# Altium schematic sheet Control.SchDoc
size A
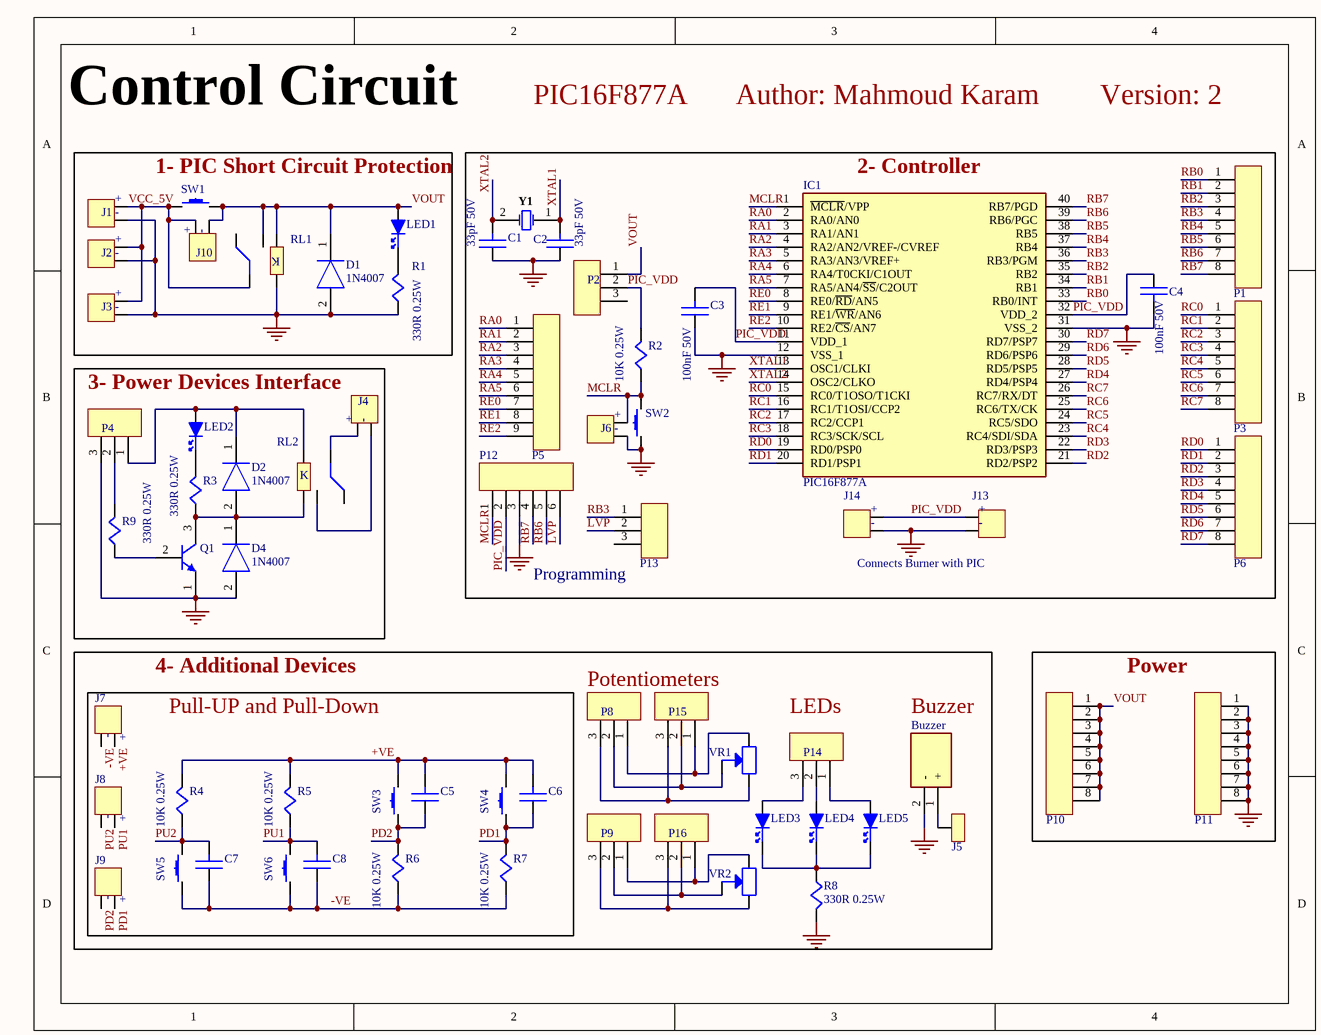
[diagram p0: Control.SchDoc]

## Parts
Buzzer  Buzzer 5V  [Buzzer 7.62mm pitch 12mm dia]  (value not drawn)
C1  33pF 50V  [Cap Ceramic 104]
C2  33pF 50V  [Cap Ceramic 104]
C3  100nF 50V  [Cap Ceramic 104 2.54]
C4  100nF 50V  [Cap Ceramic 104 2.54]
C5  100nF 50V  [Cap Ceramic 104]  (value not drawn)
C6  100nF 50V  [Cap Ceramic 104]  (value not drawn)
C7  100nF 50V  [Cap Ceramic 104]  (value not drawn)
C8  100nF 50V  [Cap Ceramic 104]  (value not drawn)
D1  1N4007  [Diode 10.16mm TH H]
D2  1N4007  [Diode 2.54mm TH V]
D4  1N4007  [Diode 2.54mm TH V]
IC1  PIC16F877A  [PIC16F877A TH With Socket]
J1  JST on PCB Connector 2 pins  [JST_B2B TH]  (value not drawn)
J2  Terminal Block Green 5.08mm  [Screw Terminal Block 5.08mm TH Green]  (value not drawn)
J3  DC Power Jack PJ002  [DC Power Jack 2.1mm PJ-002AH TH]  (value not drawn)
J4  Terminal Block Blue 5.08mm  [Screw Terminal Block 5.08mm TH Blue]  (value not drawn)
J5  Pin  [Pin]  (value not drawn)
J6  Header male 2 ways  [Header Male 2.54mm 2 Pins TH]  (value not drawn)
J7  Header male 2 ways  [Header Male 2.54mm 2 Pins TH]  (value not drawn)
J8  Header male 2 ways  [Header Male 2.54mm 2 Pins TH]  (value not drawn)
J9  Header male 2 ways  [Header Male 2.54mm 2 Pins TH]  (value not drawn)
J10  Header male 2 ways  [Header Male 2.54mm 2 Pins TH]  (value not drawn)
J13  Header male 2 ways  [Header Male 2.54mm 2 Pins TH]  (value not drawn)
J14  Header male 2 ways  [Header Male 2.54mm 2 Pins TH]  (value not drawn)
LED1  RED 5mm  [LED 5mm Red TH]  (value not drawn)
LED2  Green 5mm  [LED 5mm Green TH]  (value not drawn)
LED3  RED 5mm  [LED 5mm Red TH]  (value not drawn)
LED4  Green 5mm  [LED 5mm Green TH]  (value not drawn)
LED5  Yellow 5mm  [LED 5mm Yellow TH]  (value not drawn)
P1  Header male 8 ways  [Header Male 2.54mm 8 Pins TH]  (value not drawn)
P2  Header male 3 ways with jumper  [Header Male 2.54mm 3 Pins with jumper TH]  (value not drawn)
P3  Header male 8 ways  [Header Male 2.54mm 8 Pins TH]  (value not drawn)
P4  Header male 3 ways  [Header Male 2.54mm 3 Pins TH]  (value not drawn)
P5  Header male 9 ways  [Header Male 2.54mm 9 Pins TH]  (value not drawn)
P6  Header male 8 ways  [Header Male 2.54mm 8 Pins TH]  (value not drawn)
P8  Header male 3 ways  [Header Male 2.54mm 3 Pins TH]  (value not drawn)
P9  Header male 3 ways  [Header Male 2.54mm 3 Pins TH]  (value not drawn)
P10  Header male 8 ways  [Header Male 2.54mm 8 Pins TH]  (value not drawn)
P11  Header male 8 ways  [Header Male 2.54mm 8 Pins TH]  (value not drawn)
P12  Header male 6 ways  [Header Male 2.54mm 6 Pins TH]  (value not drawn)
P13  Header male 3 ways with jumper  [Header Male 2.54mm 3 Pins with jumper TH]  (value not drawn)
P14  Header male 3 ways  [Header Male 2.54mm 3 Pins TH]  (value not drawn)
P15  Header male 3 ways  [Header Male 2.54mm 3 Pins TH]  (value not drawn)
P16  Header male 3 ways  [Header Male 2.54mm 3 Pins TH]  (value not drawn)
Q1  Transistor PN2222  [PN2222]  (value not drawn)
R1  330R 0.25W  [Res 7.62mm H TH]
R2  10K 0.25W  [Res 7.62mm H TH]
R3  330R 0.25W  [Res 2.54mm V TH]
R4  10K 0.25W  [Res 2.54mm V TH]
R5  10K 0.25W  [Res 2.54mm V TH]
R6  10K 0.25W  [Res 2.54mm V TH]
R7  10K 0.25W  [Res 2.54mm V TH]
R8  330R 0.25W  [Res 7.62mm H TH]
R9  330R 0.25W  [Res 2.54mm V TH]
RL1  Relay 5V SRD-05VDC-SL-C  [Relay SRD-05VDC-SL-C]  (value not drawn)
RL2  Relay 5V SRD-05VDC-SL-C  [Relay SRD-05VDC-SL-C]  (value not drawn)
SW1  Tactile Switch 4 poles  [Tactile switch 6*6*5 TH]  (value not drawn)
SW2  Tactile Switch 4 poles  [Tactile switch 6*6*5 TH]  (value not drawn)
SW3  Tactile Switch 4 poles  [Tactile switch 6*6*5 TH]  (value not drawn)
SW4  Tactile Switch 4 poles  [Tactile switch 6*6*5 TH]  (value not drawn)
SW5  Tactile Switch 4 poles  [Tactile switch 6*6*5 TH]  (value not drawn)
SW6  Tactile Switch 4 poles  [Tactile switch 6*6*5 TH]  (value not drawn)
VR1  Potentiometer 10K  [Potentiometer 90 deg dual]  (value not drawn)
VR2  Potentiometer 10K  [Potentiometer 90 deg dual]  (value not drawn)
Y1  Crystal 8MHz  [FOX-FOXSLF-2_V]  (value not drawn)

## Blocks framed on the sheet
1- PIC Short Circuit Protection: D1 J1-J3 J10 LED1 R1 RL1 SW1
2- Controller: C1-C4 IC1 J6 J13 J14 P1-P3 P5 P6 P12 P13 R2 SW2 Y1
3- Power Devices Interface: D2 D4 J4 LED2 P4 Q1 R3 R9 RL2
Power: P10 P11

## Nets
GND: Buzzer.2(-) C1.1 C2.1 C3.1 C4.2 D1.2(A) D4.2(A) IC1.12(VSS_1) IC1.31(VSS_2) J1.2 J2.2 J3.2 J6.2 J13.2 J14.2 P4.3 P11.1 P11.2 P11.3 P11.4 P11.5 P11.6 P11.7 P11.8 P12.3 Q1.1(E) R1.1 R8.2 RL1.2 SW2.1
+VE: C5.2 C6.2 J7.1 R4.2 R5.2 SW3.2 SW4.2
-VE: C7.1 C8.1 J7.2 R6.1 R7.1 SW5.1 SW6.1
LVP: P12.6 P13.2
MCLR: IC1.1(~{MCLR}/VPP) J6.1 P12.1 R2.1 SW2.2
PD1: C6.1 J9.1 R7.2 SW4.1
PD2: C5.1 J9.2 R6.2 SW3.1
PIC_VDD: C3.2 C4.1 IC1.11(VDD_1) IC1.32(VDD_2) J13.1 J14.1 P2.2 P12.2 R2.2
PU1: C8.2 J8.1 R5.1 SW6.2
PU2: C7.2 J8.2 R4.1 SW5.2
RA0: IC1.2(RA0/AN0) P5.1
RA1: IC1.3(RA1/AN1) P5.2
RA2: IC1.4(RA2/AN2/VREF-/CVREF) P5.3
RA3: IC1.5(RA3/AN3/VREF+) P5.4
RA4: IC1.6(RA4/T0CKI/C1OUT) P5.5
RA5: IC1.7(RA5/AN4/~{SS}/C2OUT) P5.6
RB0: IC1.33(RB0/INT) P1.1
RB1: IC1.34(RB1) P1.2
RB2: IC1.35(RB2) P1.3
RB3: IC1.36(RB3/PGM) P1.4 P13.1
RB4: IC1.37(RB4) P1.5
RB5: IC1.38(RB5) P1.6
RB6: IC1.39(RB6/PGC) P1.7 P12.5
RB7: IC1.40(RB7/PGD) P1.8 P12.4
RC0: IC1.15(RC0/T1OSO/T1CKI) P3.1
RC1: IC1.16(RC1/T1OSI/CCP2) P3.2
RC2: IC1.17(RC2/CCP1) P3.3
RC3: IC1.18(RC3/SCK/SCL) P3.4
RC4: IC1.23(RC4/SDI/SDA) P3.5
RC5: IC1.24(RC5/SDO) P3.6
RC6: IC1.25(RC6/TX/CK) P3.7
RC7: IC1.26(RC7/RX/DT) P3.8
RD0: IC1.19(RD0/PSP0) P6.1
RD1: IC1.20(RD1/PSP1) P6.2
RD2: IC1.21(RD2/PSP2) P6.3
RD3: IC1.22(RD3/PSP3) P6.4
RD4: IC1.27(RD4/PSP4) P6.5
RD5: IC1.28(RD5/PSP5) P6.6
RD6: IC1.29(RD6/PSP6) P6.7
RD7: IC1.30(RD7/PSP7) P6.8
RE0: IC1.8(RE0/~{RD}/AN5) P5.7
RE1: IC1.9(RE1/~{WR}/AN6) P5.8
RE2: IC1.10(RE2/~{CS}/AN7) P5.9
VCC_5V: J1.1 J2.1 J3.1 J10.1 RL1.1(COM) SW1.1
VOUT: D1.1(K) J10.2 LED1.1 P2.1 P10.1 P10.2 P10.3 P10.4 P10.5 P10.6 P10.7 P10.8 RL1.3 RL1.5(NO) SW1.2
XTAL1: C2.2 IC1.13(OSC1/CLKI) Y1.1
XTAL2: C1.2 IC1.14(OSC2/CLKO) Y1.2
NetBuzzer_1: Buzzer.1(+) J5.1
NetD2_1: D2.1(K) LED2.1 P4.1 RL2.2
NetD2_2: D2.2(A) D4.1(K) Q1.3(C) R3.1 RL2.3
NetJ4_1: J4.1 RL2.1(COM)
NetJ4_2: J4.2 RL2.5(NO)
NetLED1_2: LED1.2 R1.2
NetLED2_2: LED2.2 R3.2
NetLED3_1: LED3.1 P14.3
NetLED3_2: LED3.2 LED4.2 LED5.2 R8.1
NetLED4_1: LED4.1 P14.2
NetLED5_1: LED5.1 P14.1
NetP4_2: P4.2 R9.2
NetP8_1: P8.1 P15.1 VR1.1
NetP8_2: P8.2 P15.2 VR1.2
NetP8_3: P8.3 P15.3 VR1.3
NetP9_1: P9.1 P16.1 VR2.1
NetP9_2: P9.2 P16.2 VR2.2
NetP9_3: P9.3 P16.3 VR2.3
NetQ1_2: Q1.2(B) R9.1

Not connected (* = marked no-connect by the designer): P2 3; P13 3; RL1 4(NC); RL2 4(NC)

## Notes on the sheet
- Control Circuit
- PIC16F877A
- Author: Mahmoud Karam
- Version: 2
- (near P13) Programming
- Connects Burner with PIC
- 4- Additional Devices
- Pull-UP and Pull-Down
- Potentiometers
- LEDs
- Buzzer
- (in symbol Relay_SPDT) K
- (in symbol Terminal_Block_2Pos) +; -

## Library data of the parts
Buzzer = Speaker: Loudspeaker or Buzzer; Manufacturer_Name: RS Components; Manufacturer_Part_Number: 7243178; Datasheet Link: https://docs.rs-online.com/093f/0900766b815817dd.pdf; Height: 14.5mm
C1 C2 = Ceramic_Capacitors: Capacitor Ceramic; Manufacturer: KEMET; Manufacturer Part Number: C320C104M5R5TA7301; Lead/Base Style: Straight; Dissipation Factor: 2.5%; Capacitance: 100nF; Dielectric: X7R; Tolerance: 20%; Lead Diameter: 0.51mm; Supplier 1: Digi-Key; RoHS: Yes; Category: Ceramic Capacitors; Stock 1: 8222; Pricing 1: 1=0.24000, 10=0.16200, 50=0.10800, 100=0.09180, 500=0.06480, 1000=0.05670 (USD); Case/Package: Dipped; Min Operating Temperature: -55°C; Max Operating Temperature: 125°C; Termination: Radial; Packaging: Tape and Reel; Package Quantity: 2500; Voltage Rating: 50V; Length: 6.6mm; Width: 5.08mm; Height: 3.18mm; Lead Pitch: 2.54mm; Depth: 3.18mm; ComponentLink1URL: https://datasheet.ciiva.com/5396/f3101-goldmax-5396597.pdf?src-supplier=Mouser; ComponentLink1Description: https://datasheet.ciiva.com/5396/f3101-goldmax-5396597.pdf?src-supplier=Mouser; Supplier Part Number 1: 399-13978-1-ND
C3-C8 = Ceramic_Capacitors: Capacitor Ceramic; Manufacturer: KEMET; Manufacturer Part Number: C320C104M5R5TA7301; Lead/Base Style: Straight; Dissipation Factor: 2.5%; Dielectric: X7R; Tolerance: 20%; Lead Diameter: 0.51mm; Supplier 1: Digi-Key; RoHS: Yes; Category: Ceramic Capacitors; Stock 1: 8222; Pricing 1: 1=0.24000, 10=0.16200, 50=0.10800, 100=0.09180, 500=0.06480, 1000=0.05670 (USD); Case/Package: Dipped; Min Operating Temperature: -55°C; Max Operating Temperature: 125°C; Termination: Radial; Capacitance: 100nF; Packaging: Tape and Reel; Package Quantity: 2500; Voltage Rating: 50V; Length: 6.6mm; Width: 5.08mm; Height: 3.18mm; Lead Pitch: 2.54mm; Depth: 3.18mm; ComponentLink1URL: https://datasheet.ciiva.com/5396/f3101-goldmax-5396597.pdf?src-supplier=Mouser; ComponentLink1Description: https://datasheet.ciiva.com/5396/f3101-goldmax-5396597.pdf?src-supplier=Mouser; Supplier Part Number 1: 399-13978-1-ND
D1 D2 D4 = Diodes: Manufacturer_Name: Vishay; Manufacturer_Part_Number: 1N4007-E3/53; Datasheet Link: http://www.vishay.com/docs/88503/1n4001.pdf; Arrow Part Number: 1N4007-E3/53; Arrow Price/Stock: https://www.arrow.com/en/products/1n4007-e353/vishay; Mouser Part Number: 625-1N4007-E3/53; Mouser Price/Stock: https://www.mouser.co.uk/ProductDetail/Vishay-General-Semiconductor/1N4007-E3-53?qs=N4vtoAxH%2FSpFgYSIWmQOdg%3D%3D
IC1 = PIC16F877A: Integrated Circuit; Manufacturer_Name: Microchip; Manufacturer_Part_Number: PIC16F877A-I/P; Datasheet Link: http://componentsearchengine.com/Datasheets/1/PIC16F877A-I_P.pdf; Height: 4.83mm; Arrow Part Number: PIC16F877A-I/P; Arrow Price/Stock: https://www.arrow.com/en/products/pic16f877a-ip/microchip-technology; Mouser Part Number: 579-PIC16F877A-I/P; Mouser Price/Stock: https://www.mouser.co.uk/ProductDetail/Microchip-Technology/PIC16F877A-I-P?qs=Vn0zuzr35GH%252Bfm6E5Siyuw%3D%3D
J1 J3 J6-J10 J13 J14 = Terminal_Block_2Pos: Terminals 2POS; Manufacturer: Phoenix Contact; Manufacturer Part Number: 1729128; Current Rating: 13.5A; Number of Poles: 2; Voltage Rating: 400V; Number of Levels: 1; Current: 10A; Voltage: 300V; Connector Type: Screw; Test Voltage: 4kV; Wire Gauge (Max): 26AWG; Wire Gauge (Min): 14AWG; Pitch: 5.08mm; Approvals: UL,CSA; Supplier 1: Digi-Key; RoHS: Yes; Category: Terminal Blocks; Stock 1: 9869; Pricing 1: 1=1.09000, 10=1.04700, 50=1.00100, 100=0.97370, 250=0.91000, 500=0.83720, 1000=0.77350, 2500=0.73710, 5000=0.69160 (USD); Mount: Through Hole; Number of Pins: 2; Housing Material: Polyamide; Color: Green; Weight: 0.069842oz; Housing Color: Green; Insulation Material: Nylon; Contact Material: Tin; Min Operating Temperature: -20°C; Max Operating Temperature: 100°C; Package Quantity: 50; Packaging: Bulk; Termination: Screw; Max Current Rating: 13.5A; Number of Rows: 1; Max Supply Voltage: 400V; Number of Positions Per Level: 2; Number of Positions: 2; Number of Contacts: 2; Number of Circuits: 2; Orientation: Straight; Length: 8.1mm; Width: 13.5mm; Height: 13.5mm; Depth: 8.1mm; Wire/Cable Gauge: 26AWG; Radiation Hardening: No; Lead Free: Lead Free; REACH SVHC: No SVHC; Flammability Rating: UL94 V-0; ComponentLink1URL: https://datasheet.ciiva.com/823/1729128-823779.pdf?src-supplier=Digi-Key; ComponentLink1Description: https://datasheet.ciiva.com/823/1729128-823779.pdf?src-supplier=Digi-Key; ComponentLink2URL: https://datasheet.ciiva.com/15169/getdatasheetpartid-199310-15169845.pdf?src-supplier=Verical; ComponentLink2Description: https://datasheet.ciiva.com/15169/getdatasheetpartid-199310-15169845.pdf?src-supplier=Verical; ComponentLink3URL: https://datasheet.ciiva.com/16046/1729128-16046181.pdf?src-supplier=Onlinecomponents.com; ComponentLink3Description: https://datasheet.ciiva.com/16046/1729128-16046181.pdf?src-supplier=Onlinecomponents.com; ComponentLink4URL: https://datasheet.ciiva.com/14607/70054405-14607157.pdf?src-supplier=Allied+Electronics; ComponentLink4Description: https://datasheet.ciiva.com/14607/70054405-14607157.pdf?src-supplier=Allied+Electronics; ComponentLink5URL: https://datasheet.ciiva.com/29218/743664-da-01-en-printklemmenblock-mkdsn-1-5-2-5-08-29218154.pdf?src-supplier=Conrad; ComponentLink5Description: https://datasheet.ciiva.com/29218/743664-da-01-en-printklemmenblock-mkdsn-1-5-2-5-08-29218154.pdf?src-supplier=Conrad; Supplier Part Number 1: 277-1247-ND
J2 J4 = Terminal_Block_2Pos: Terminals 2POS; Manufacturer: Phoenix Contact; Manufacturer Part Number: 1729128; Current Rating: 13.5A; Number of Poles: 2; Voltage Rating: 400V; Number of Levels: 1; Current: 10A; Voltage: 300V; Connector Type: Screw; Test Voltage: 4kV; Wire Gauge (Max): 26AWG; Wire Gauge (Min): 14AWG; Approvals: UL,CSA; Supplier 1: Digi-Key; RoHS: Yes; Category: Terminal Blocks; Stock 1: 9869; Pricing 1: 1=1.09000, 10=1.04700, 50=1.00100, 100=0.97370, 250=0.91000, 500=0.83720, 1000=0.77350, 2500=0.73710, 5000=0.69160 (USD); Mount: Through Hole; Number of Pins: 2; Housing Material: Polyamide; Color: Green; Weight: 0.069842oz; Housing Color: Green; Insulation Material: Nylon; Contact Material: Tin; Min Operating Temperature: -20°C; Max Operating Temperature: 100°C; Package Quantity: 50; Packaging: Bulk; Termination: Screw; Max Current Rating: 13.5A; Number of Rows: 1; Max Supply Voltage: 400V; Number of Positions Per Level: 2; Number of Positions: 2; Number of Contacts: 2; Number of Circuits: 2; Orientation: Straight; Length: 8.1mm; Width: 13.5mm; Height: 13.5mm; Depth: 8.1mm; Wire/Cable Gauge: 26AWG; Pitch: 5.08mm; Radiation Hardening: No; Lead Free: Lead Free; REACH SVHC: No SVHC; Flammability Rating: UL94 V-0; ComponentLink1URL: https://datasheet.ciiva.com/823/1729128-823779.pdf?src-supplier=Digi-Key; ComponentLink1Description: https://datasheet.ciiva.com/823/1729128-823779.pdf?src-supplier=Digi-Key; ComponentLink2URL: https://datasheet.ciiva.com/15169/getdatasheetpartid-199310-15169845.pdf?src-supplier=Verical; ComponentLink2Description: https://datasheet.ciiva.com/15169/getdatasheetpartid-199310-15169845.pdf?src-supplier=Verical; ComponentLink3URL: https://datasheet.ciiva.com/16046/1729128-16046181.pdf?src-supplier=Onlinecomponents.com; ComponentLink3Description: https://datasheet.ciiva.com/16046/1729128-16046181.pdf?src-supplier=Onlinecomponents.com; ComponentLink4URL: https://datasheet.ciiva.com/14607/70054405-14607157.pdf?src-supplier=Allied+Electronics; ComponentLink4Description: https://datasheet.ciiva.com/14607/70054405-14607157.pdf?src-supplier=Allied+Electronics; ComponentLink5URL: https://datasheet.ciiva.com/29218/743664-da-01-en-printklemmenblock-mkdsn-1-5-2-5-08-29218154.pdf?src-supplier=Conrad; ComponentLink5Description: https://datasheet.ciiva.com/29218/743664-da-01-en-printklemmenblock-mkdsn-1-5-2-5-08-29218154.pdf?src-supplier=Conrad; Supplier Part Number 1: 277-1247-ND
LED1 LED3 = LEDs_Single: LEDs; Manufacturer: Vishay Semiconductors; Manufacturer Part Number: TLDR5400; Dominant Wavelength: 648nm; Test Current: 20mA; Lens Transparency: Diffused; Number of Elements: 1; Power Dissipation: 100mW; Wavelength: 650nm; Luminous Intensity: 70mcd; Viewing Angle: 30°; Forward Voltage: 1.8V; Lens Style: Diffused,Dome,Colored,Circular,Round; Reverse Voltage: 6V; Lead Length: 24mm; Supplier 1: Allied Electronics; RoHS: Yes; Category: LEDs; Pricing 1: 4000=0.13000, 40000=0.12800, 100000=0.12600 (USD); Mount: Through Hole; Case/Package: Radial; Number of Pins: 2; Color: Red; Min Operating Temperature: -40°C; Max Operating Temperature: 100°C; Number of LEDs: 1; Forward Current: 20mA; Packaging: Bulk; Package Quantity: 4000; Illumination Color: Red; Diameter: 5mm; Length: 5.8mm; Height: 8.7mm; Depth: 5.8mm; Radiation Hardening: No; REACH SVHC: Unknown; ComponentLink1URL: https://datasheet.ciiva.com/28652/tldr5400-28652624.pdf?src-supplier=Element14; ComponentLink1Description: https://datasheet.ciiva.com/28652/tldr5400-28652624.pdf?src-supplier=Element14; ComponentLink2URL: https://datasheet.ciiva.com/7639/6597-7639122.pdf?src-supplier=Element14; ComponentLink2Description: https://datasheet.ciiva.com/7639/6597-7639122.pdf?src-supplier=Element14; ComponentLink3URL: https://datasheet.ciiva.com/4691/tldr5400-240375-4691911.pdf?src-supplier=Mouser; ComponentLink3Description: https://datasheet.ciiva.com/4691/tldr5400-240375-4691911.pdf?src-supplier=Mouser; ComponentLink4URL: https://datasheet.ciiva.com/18446/70061525-18446460.pdf?src-supplier=Allied+Electronics; ComponentLink4Description: https://datasheet.ciiva.com/18446/70061525-18446460.pdf?src-supplier=Allied+Electronics; Supplier Part Number 1: 70061525
LED2 LED4 LED5 = LEDs_Single: LEDs; Manufacturer: Vishay Semiconductors; Manufacturer Part Number: TLDR5400; Color: Red; Dominant Wavelength: 648nm; Test Current: 20mA; Lens Transparency: Diffused; Number of Elements: 1; Power Dissipation: 100mW; Wavelength: 650nm; Luminous Intensity: 70mcd; Viewing Angle: 30°; Forward Voltage: 1.8V; Lens Style: Diffused,Dome,Colored,Circular,Round; Reverse Voltage: 6V; Lead Length: 24mm; Supplier 1: Allied Electronics; RoHS: Yes; Category: LEDs; Pricing 1: 4000=0.13000, 40000=0.12800, 100000=0.12600 (USD); Mount: Through Hole; Case/Package: Radial; Number of Pins: 2; Min Operating Temperature: -40°C; Max Operating Temperature: 100°C; Number of LEDs: 1; Forward Current: 20mA; Packaging: Bulk; Package Quantity: 4000; Illumination Color: Red; Diameter: 5mm; Length: 5.8mm; Height: 8.7mm; Depth: 5.8mm; Radiation Hardening: No; REACH SVHC: Unknown; ComponentLink1URL: https://datasheet.ciiva.com/28652/tldr5400-28652624.pdf?src-supplier=Element14; ComponentLink1Description: https://datasheet.ciiva.com/28652/tldr5400-28652624.pdf?src-supplier=Element14; ComponentLink2URL: https://datasheet.ciiva.com/7639/6597-7639122.pdf?src-supplier=Element14; ComponentLink2Description: https://datasheet.ciiva.com/7639/6597-7639122.pdf?src-supplier=Element14; ComponentLink3URL: https://datasheet.ciiva.com/4691/tldr5400-240375-4691911.pdf?src-supplier=Mouser; ComponentLink3Description: https://datasheet.ciiva.com/4691/tldr5400-240375-4691911.pdf?src-supplier=Mouser; ComponentLink4URL: https://datasheet.ciiva.com/18446/70061525-18446460.pdf?src-supplier=Allied+Electronics; ComponentLink4Description: https://datasheet.ciiva.com/18446/70061525-18446460.pdf?src-supplier=Allied+Electronics; Supplier Part Number 1: 70061525
P1 P3 P6 P10 P11 = Terminal_Block_8Pos: Male Header, Pitch 2.54 mm, 1 x 40 Position, Height 8.636 mm, Tail Length 3.05 mm, -55 to 105 degC, RoHS, Bulk; Manufacturer: 3M; Max Current Rating: 3A; Rows: 1; Contact Plating: Gold; Package Reference: 2340-6111TG; Connector Type: Header; RoHS Compliant: True; Colour: Black; Datasheet URL: https://datasheet.ciiva.com/5161/ts0766-242217-5161112.pdf; Contact Finish: Gold; Package Quantity: 200; Current Rating: 3A; Datasheet Version: Aug-08; Package Description: Male Header, Pitch 2.54 mm, 1 x 40 Position, Height 8.636 mm, Tail Length 3.05 mm; Mounting Technology: TH; Pins: 40; Max Operating Temperature: 105°C; Packaging: Bulk; Manufacturer URL: http://www.3m.com/; Min Operating Temperature: -55°C; Case/Package: 2340-6111TG; Gender: Male; Lead Pitch: 0.1inch; Contact Material: Copper
P2 P4 P8 P9 P13-P16 = Terminal_Block_3Pos: Male Header, Pitch 2.54 mm, 1 x 40 Position, Height 8.636 mm, Tail Length 3.05 mm, -55 to 105 degC, RoHS, Bulk; Manufacturer: 3M; Max Current Rating: 3A; Rows: 1; Contact Plating: Gold; Package Reference: 2340-6111TG; Connector Type: Header; RoHS Compliant: True; Colour: Black; Datasheet URL: https://datasheet.ciiva.com/5161/ts0766-242217-5161112.pdf; Contact Finish: Gold; Package Quantity: 200; Current Rating: 3A; Datasheet Version: Aug-08; Package Description: Male Header, Pitch 2.54 mm, 1 x 40 Position, Height 8.636 mm, Tail Length 3.05 mm; Mounting Technology: TH; Pins: 40; Max Operating Temperature: 105°C; Packaging: Bulk; Manufacturer URL: http://www.3m.com/; Min Operating Temperature: -55°C; Case/Package: 2340-6111TG; Gender: Male; Lead Pitch: 0.1inch; Contact Material: Copper
P5 = Terminal_Block_9Pos: Male Header, Pitch 2.54 mm, 1 x 40 Position, Height 8.636 mm, Tail Length 3.05 mm, -55 to 105 degC, RoHS, Bulk; Manufacturer: 3M; Max Current Rating: 3A; Rows: 1; Contact Plating: Gold; Package Reference: 2340-6111TG; Connector Type: Header; RoHS Compliant: True; Colour: Black; Datasheet URL: https://datasheet.ciiva.com/5161/ts0766-242217-5161112.pdf; Contact Finish: Gold; Package Quantity: 200; Current Rating: 3A; Datasheet Version: Aug-08; Package Description: Male Header, Pitch 2.54 mm, 1 x 40 Position, Height 8.636 mm, Tail Length 3.05 mm; Mounting Technology: TH; Pins: 40; Max Operating Temperature: 105°C; Packaging: Bulk; Manufacturer URL: http://www.3m.com/; Min Operating Temperature: -55°C; Case/Package: 2340-6111TG; Gender: Male; Lead Pitch: 0.1inch; Contact Material: Copper
P12 = Terminal_Block_6Pos: Male Header, Pitch 2.54 mm, 1 x 40 Position, Height 8.636 mm, Tail Length 3.05 mm, -55 to 105 degC, RoHS, Bulk; Manufacturer: 3M; Max Current Rating: 3A; Rows: 1; Contact Plating: Gold; Package Reference: 2340-6111TG; Connector Type: Header; RoHS Compliant: True; Colour: Black; Datasheet URL: https://datasheet.ciiva.com/5161/ts0766-242217-5161112.pdf; Contact Finish: Gold; Package Quantity: 200; Current Rating: 3A; Datasheet Version: Aug-08; Package Description: Male Header, Pitch 2.54 mm, 1 x 40 Position, Height 8.636 mm, Tail Length 3.05 mm; Mounting Technology: TH; Pins: 40; Max Operating Temperature: 105°C; Packaging: Bulk; Manufacturer URL: http://www.3m.com/; Min Operating Temperature: -55°C; Case/Package: 2340-6111TG; Gender: Male; Lead Pitch: 0.1inch; Contact Material: Copper
Q1 = CMP-013-00009-2: NPN General-Purpose Amplifier, 40 V, -55 to 150 degC, 3-Pin TO-92, RoHS, Bulk; Manufacturer: Fairchild; Frequency: 300MHz; hFE Min: 100; Vce Max: 1V; Elements: 1; Power: 625mW; Datasheet URL: https://www.fairchildsemi.com/datasheets/PN/PN2222A.pdf; RoHS Compliant: True; Min Operating Temperature: -55°C; Mounting Technology: TH; Package Quantity: 1000; Case/Package: TO-226-3; Package Reference: TO-92; Datasheet Version: Rev. 1.1.0, 07/2014; Package Description: 3-Pin Transistor Outline Package, Body Dia 4.79 mm, Pitch 1.27 mm; Pins: 3; Max Operating Temperature: 150°C; Packaging: Bulk
R1-R9 = Resistors_Single: Resistors; Manufacturer: Yageo; Manufacturer Part Number: CFR-25JB-52-100K; Max Power Dissipation: 250mW; Resistance: 100kR; Tolerance: 5%; Temperature Coefficient: -700ppm/°C; Supplier 1: Digi-Key; RoHS: Yes; Category: Through-Hole Resistors; Stock 1: 105911; Pricing 1: 1=0.10000, 25=0.04640, 50=0.03600, 100=0.02580, 250=0.02008, 500=0.01596, 750=0.01365, 1000=0.01133, 2000=0.00979 (USD); Case/Package: Axial; Min Operating Temperature: -55°C; Max Operating Temperature: 155°C; Package Quantity: 200; Packaging: Bulk; Power Rating: 250mW; Number of Terminations: 2; Resistor Type: Carbon Film; Length: 0.248inch; Lead Free: Lead Free; ComponentLink1URL: http://www.yageo.com/NewPortal/yageodocoutput?fileName=/pdf/throughhole/Yageo_LR_CFR_2013.pdf&src-supplier=Digi-Key; ComponentLink1Description: http://www.yageo.com/NewPortal/yageodocoutput?fileName=/pdf/throughhole/Yageo_LR_CFR_2013.pdf&src-supplier=Digi-Key; ComponentLink2URL: http://www.yageo.com/documents/recent/General%20Type_CFR.pdf?src-supplier=Future+Electronics; ComponentLink2Description: http://www.yageo.com/documents/recent/General%20Type_CFR.pdf?src-supplier=Future+Electronics; Supplier Part Number 1: 100KQBK-ND
RL1 RL2 = Relay_SPDT: Relay SPDT; Manufacturer: TE Connectivity P&B; Manufacturer Part Number: 1-1721150-0; Contact Current Rating: 15A; Voltage Rating (AC): 125V; Supplier 1: Digi-Key; RoHS: Yes; Category: Signal Relays; Stock 1: 4183; Pricing 1: 1=1.30000, 10=1.21500, 25=1.08000, 50=1.02600, 100=0.97200, 250=0.86400, 500=0.81000, 1000=0.75600, 5000=0.72900 (USD); Mount: Through Hole; Number of Pins: 5; Weight: 9.5g; Max Operating Temperature: 85°C; Packaging: Rail/Tube; Throw Configuration: SPDT; Termination: PCB; Coil Voltage (DC): 5V; Length: 19mm; Width: 15.5mm; Height: 15.8mm; Depth: 15.5mm; Lead Free: Lead Free; ELV: Compliant; ComponentLink1URL: https://datasheet.ciiva.com/14189/eng-cd-1721150-c-14189465.pdf?src-supplier=Avnet; ComponentLink1Description: https://datasheet.ciiva.com/14189/eng-cd-1721150-c-14189465.pdf?src-supplier=Avnet; ComponentLink2URL: https://datasheet.ciiva.com/48542/eng-cd-1721150-c-48542490.pdf?src-supplier=Onlinecomponents.com; ComponentLink2Description: https://datasheet.ciiva.com/48542/eng-cd-1721150-c-48542490.pdf?src-supplier=Onlinecomponents.com; Supplier Part Number 1: PB2032-ND
SW1-SW6 = Switches_2Pos: Switches; Manufacturer: E-Switch; Manufacturer Part Number: TL1105LF160Q; Actuator Material: Nylon,Polyamide; Mechanical Life: 100000Cycles; Switch Function: Off-Mom; Illumination Type: Non-Illuminated; Switch Travel: 0.25mm; Throw Configuration: SPST; Contact Current Rating: 50mA; Operating Force: 160gf; Voltage Rating (DC): 12V; Max Voltage Rating (DC): 50V; Contact Resistance: 100mR; Actuator Type: Standard; Actuator Length: 13.4mm; Supplier 1: Digi-Key; RoHS: Yes; Category: Tactile Switches; Stock 1: 17577; Pricing 1: 1=0.29000, 10=0.27800, 25=0.26400, 100=0.23900, 250=0.21792, 500=0.20256, 1000=0.17280, 2500=0.16800, 5000=0.15840 (USD); Mount: Through Hole; Housing Material: Nylon; Contact Material: Silver,Bronze; Color: Black; Contact Plating: Silver; Min Operating Temperature: -20°C; Max Operating Temperature: 70°C; Orientation: Straight; Termination: PC Pin; Electrical Life: 100000Cycles; Package Quantity: 750; Packaging: Bulk; Current Rating: 50mA; Width: 6mm; Lead Free: Lead Free; ComponentLink1URL: https://datasheet.ciiva.com/16156/p010009-16156269.pdf?src-supplier=Onlinecomponents.com; ComponentLink1Description: https://datasheet.ciiva.com/16156/p010009-16156269.pdf?src-supplier=Onlinecomponents.com; ComponentLink2URL: https://datasheet.ciiva.com/2900/tl1105-2900888.pdf?src-supplier=Digi-Key; ComponentLink2Description: https://datasheet.ciiva.com/2900/tl1105-2900888.pdf?src-supplier=Digi-Key; Supplier Part Number 1: EG2505-ND
VR1 VR2 = VariableResistors: Variable Resistors; Manufacturer: Bourns; Manufacturer Part Number: 3296W-1-502RLF; Number of Turns: 25; Temperature Coefficient: 100ppm/°C; Power Rating: 500mW; Resistance: 5kR; Tolerance: 10%; Supplier 1: Digi-Key; RoHS: Yes; Category: Variable Resistors and Potentiometers; Stock 1: 1194; Pricing 1: 1=3.74000, 10=3.27600, 25=2.92520, 50=2.74960, 100=2.69100, 250=2.57400, 500=2.10600 (USD); Mount: Through Hole; Weight: 0.03oz; Min Operating Temperature: -55°C; Max Operating Temperature: 125°C; Termination: Pin; Taper: Linear; Packaging: Tape and Reel; Max Power Dissipation: 500mW; Package Quantity: 1000; Resistor Type: Cermet; Length: 9.53mm; Width: 4.83mm; Height: 0.395inch; Depth: 4.83mm; Radiation Hardening: No; Military Standard: Not; ComponentLink1URL: https://datasheet.ciiva.com/8088/3296-8088713.pdf?src-supplier=Avnet; ComponentLink1Description: https://datasheet.ciiva.com/8088/3296-8088713.pdf?src-supplier=Avnet; ComponentLink2URL: https://datasheet.ciiva.com/16807/3296-16807737.pdf?src-supplier=Avnet+Europe; ComponentLink2Description: https://datasheet.ciiva.com/16807/3296-16807737.pdf?src-supplier=Avnet+Europe; ComponentLink3URL: https://datasheet.ciiva.com/2162/3296-2162778.pdf?src-supplier=Digi-Key; ComponentLink3Description: https://datasheet.ciiva.com/2162/3296-2162778.pdf?src-supplier=Digi-Key; Supplier Part Number 1: 3296W-1-502RLFCT-ND
Y1 = CMP-003-00026-1: Resistance Weld Thru-Hole Crystal, 12 MHz, +/-30 ppm, 20 pF, -20 to 70 degC, 2-Pin THD, RoHS, Bulk; Manufacturer: FOX Electronics; Resistance: 60Ohm; Frequency: 12MHz; Load Capacitance: 20pF; ESR: 60; Frequency Tolerance: 30ppm; Tolerance: 50ppm; Packaging: Bulk; Pins: 2; Mounting Technology: TH; Max Operating Temperature: 70°C; RoHS Compliant: True; Case/Package: FOXSLF-2; Manufacturer URL: http://www.foxonline.com/; Datasheet URL: http://www.foxonline.com/pdfs/hc49slf.pdf; Datasheet Version: Mar-15; Package Quantity: 100; Min Operating Temperature: -20°C; Package Reference: FOXSLF-2; Package Description: 2-Pin Through Hole Device, Body 11.35 x 4.65 mm, Pitch 4.88 mm